# Altium schematic sheet MCU098_07_Hardware.SchDoc: Hardware
size 431 x 279 mm; Date: Not shown in title block; ApprovedBy: Not shown in title block; CheckedBy: Not shown in title block; Author: Not shown in title block; CompanyName: Not shown in title block; DrawnBy: Johnson He; Engineer: Not shown in title block; Organization: Not shown in title block; Address1: Not shown in title block; Address2: Not shown in title block; Address3: Not shown in title block; Address4: Not shown in title block; DocumentNumber: 1; Revision: Use project parameter SCH_Rev; SheetNumber: 7; SheetTotal: 7; PageSetup: Record=PageOptions|CenterHorizontal=True|CenterVertical=True|PrintScale=1.00|XCorrection=1.00|YCorrection=1.00|PrintKind=0|BorderSize=5000000|LeftOffset=0|BottomOffset=0|Orientation=2|PaperLength=1000|PaperWidth=1000|Scale=100|PaperSource=15|PrintQuality=600|MediaType=1|DitherType=10|PaperKind=Letter|PrintScaleMode=1; CurrentTime: Not shown in title block; CurrentDate: Not shown in title block; Time: Not shown in title block; DocumentFullPathAndName: Not shown in title block; DocumentName: Not shown in title block; ModifiedDate: Not shown in title block; ImagePath: Not shown in title block
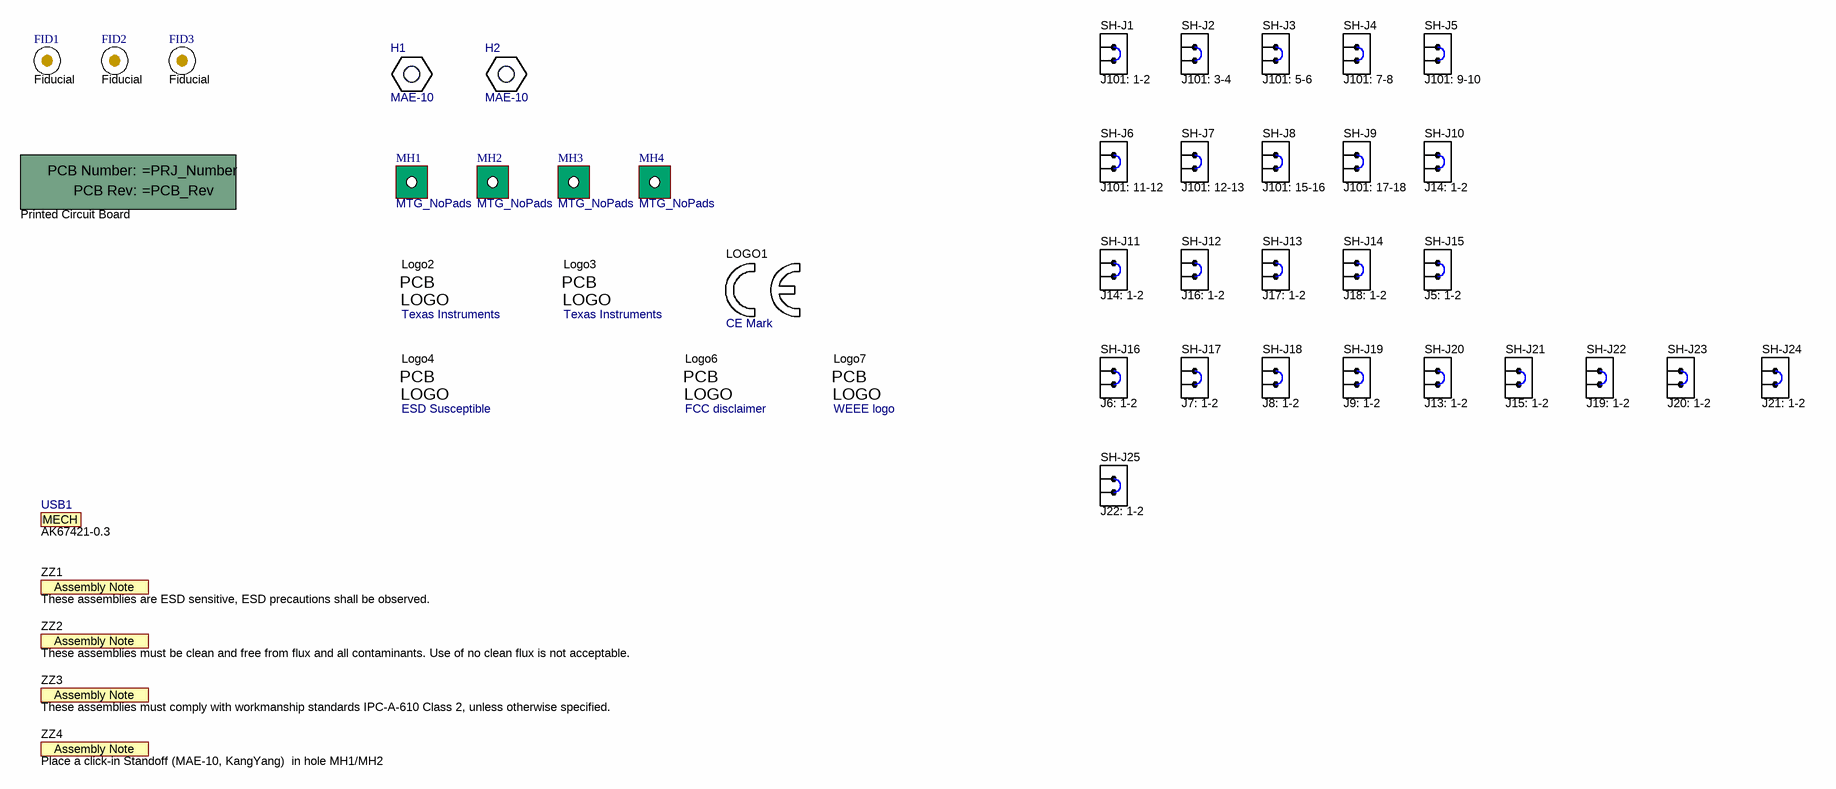
[diagram p0: MCU098_07_Hardware.SchDoc]

## Parts
!PCB1  Printed Circuit Board  (mechanical)
FID1  Fiducial  [Fiducial10-30]
FID2  Fiducial  [Fiducial10-30]
FID3  Fiducial  [Fiducial10-30]
H1  MAE-10  [KY_MAE-10]
H2  MAE-10  [KY_MAE-10]
LOGO1  CE Mark  [CE_Mark_5mm]  (no BOM)
Logo2  Texas Instruments  [TI_Horizontal_Overlay_Small]  (no BOM)
Logo3  Texas Instruments  [TI_Horizontal_Overlay_Medium]  (no BOM)
Logo4  ESD Susceptible  [ESD_Overlay_Large]  (no BOM)
Logo6  FCC disclaimer  [FCC_disclaimer]  (no BOM)
Logo7  WEEE logo  [WEEE_Minimum]  (no BOM)
MH1  MTG_NoPads  [NPTH125mil]  (no BOM)
MH2  MTG_NoPads  [NPTH125mil]  (no BOM)
MH3  MTG_NoPads  [NPTH125mil]  (no BOM)
MH4  MTG_NoPads  [NPTH125mil]  (no BOM)
SH-J1  value J101: 1-2  [SNT-100-BK-G]  (hidden comment: SNT-100-BK-G)
SH-J2  value J101: 3-4  [SNT-100-BK-G]  (hidden comment: SNT-100-BK-G)
SH-J3  value J101: 5-6  [SNT-100-BK-G]  (hidden comment: SNT-100-BK-G)
SH-J4  value J101: 7-8  [SNT-100-BK-G]  (hidden comment: SNT-100-BK-G)
SH-J5  value J101: 9-10  [SNT-100-BK-G]  (hidden comment: SNT-100-BK-G)
SH-J6  value J101: 11-12  [SNT-100-BK-G]  (hidden comment: SNT-100-BK-G)
SH-J7  value J101: 12-13  [SNT-100-BK-G]  (hidden comment: SNT-100-BK-G)
SH-J8  value J101: 15-16  [SNT-100-BK-G]  (hidden comment: SNT-100-BK-G)
SH-J9  value J101: 17-18  [SNT-100-BK-G]  (hidden comment: SNT-100-BK-G)
SH-J10  value J14: 1-2  [SNT-100-BK-G]  (hidden comment: SNT-100-BK-G)
SH-J11  value J14: 1-2  [SNT-100-BK-G]  (hidden comment: SNT-100-BK-G)
SH-J12  value J16: 1-2  [SNT-100-BK-G]  (hidden comment: SNT-100-BK-G)
SH-J13  value J17: 1-2  [SNT-100-BK-G]  (hidden comment: SNT-100-BK-G)
SH-J14  value J18: 1-2  [SNT-100-BK-G]  (hidden comment: SNT-100-BK-G)
SH-J15  value J5: 1-2  [SNT-100-BK-G]  (hidden comment: SNT-100-BK-G)
SH-J16  value J6: 1-2  [SNT-100-BK-G]  (hidden comment: SNT-100-BK-G)
SH-J17  value J7: 1-2  [SNT-100-BK-G]  (hidden comment: SNT-100-BK-G)
SH-J18  value J8: 1-2  [SNT-100-BK-G]  (hidden comment: SNT-100-BK-G)
SH-J19  value J9: 1-2  [SNT-100-BK-G]  (hidden comment: SNT-100-BK-G)
SH-J20  value J13: 1-2  [SNT-100-BK-G]  (hidden comment: SNT-100-BK-G)
SH-J21  value J15: 1-2  [SNT-100-BK-G]  (hidden comment: SNT-100-BK-G)
SH-J22  value J19: 1-2  [SNT-100-BK-G]  (hidden comment: SNT-100-BK-G)
SH-J23  value J20: 1-2  [SNT-100-BK-G]  (hidden comment: SNT-100-BK-G)
SH-J24  value J21: 1-2  [SNT-100-BK-G]  (hidden comment: SNT-100-BK-G)
SH-J25  value J22: 1-2  [SNT-100-BK-G]  (hidden comment: SNT-100-BK-G)
USB1  AK67421-0.3  (mechanical)
ZZ1  These assemblies are ESD sensitive, ESD precautions shall be observed.  [AssemblyNote]  (no BOM)
ZZ2  These assemblies must be clean and free from flux and all contaminants. Use of no clean flux is not acceptable.  [AssemblyNote]  (no BOM)
ZZ3  These assemblies must comply with workmanship standards IPC-A-610 Class 2, unless otherwise specified.  [AssemblyNote]  (no BOM)
ZZ4  Place a click-in Standoff (MAE-10, KangYang)  in hole MH1/MH2  [AssemblyNote]  (no BOM)

## Notes on the sheet
- Drawn By:
- SVN Rev:
- Number:
- TID #:
- Orderable:
- Rev:
- Sheet Title:
- File:
- Project Title:
- Designed for:
- Assembly Variant:
- Mod. Date:
- Sheet:
- Size:
- of
- B
- http://www.ti.com
- Texas Instruments and/or its licensors do not warrant the accuracy or completeness of this specification or any information contained therein. Texas Instruments and/or its licensors do not warrant that this design will meet the specifications, will be suitable for your application or fit for any particular purpose, or will operate in an implementation. Texas Instruments and/or its licensors do not warrant that the design is production worthy. You should completely validate and test your design implementation to confirm the system functionality for your application.
- Engineer:
- Contact:
- © Texas Instruments
- (in symbol AssemblyNote) Assembly Note
- (in symbol CMP-0003618-2) PCB Number:; PCB Rev:
- (in symbol CMP-0074769-1) PCB; LOGO
- (in symbol CMP-0074838-1) PCB; LOGO
- (in symbol CMP-0074840-1) PCB; LOGO
- (in symbol CMP-0074847-1) PCB; LOGO
- (in symbol CMP-0077983-1) MECH

## Library data of the parts
!PCB1 = CMP-0003618-2: Manufacturer: Any; PartNumber: =PRJ_Number; LatestRevisionDate: 2017-03-09; CompType: PCB; Publisher: Texas Instruments; RoHS: O; MountType: N/A; Key: PCB
FID1-FID3 = CMP-0077181-1: Fiducial mark.  There is nothing to buy or mount.; CompType: Fiducial; PackageReference: N/A; Library Reference: Fiducial; ClassName: FiducialMark; Manufacturer: N/A; MountType: N/A; PartNumber: N/A
H1 H2 = CMP-0077978-1: Spacer Support, Nylon 66; Manufacturer: Kang Yang; CompType: Standoff; PartNumber: MAE-10; Key: MAE-10; PackageReference: Spacer Nylon Support; ComponentLink1Description: Datasheet Link; MountType: N/A; ComponentLink1URL: https://sps16.itg.ti.com/sites/KMS/crossdivteams/altium/docs/ComponentDatasheets/1104004000018---MAE-10.pdf; RoHS: Y
LOGO1 = CMP-0074844-1: SymbolCreator: a0412235; Publisher: Texas Instruments; Library Reference: CE Mark; Lib Reference: CE Mark; LatestRevisionDate: 2017-07-06; PartNumber: CE Mark; Published: 2009-03-03
Logo2 Logo3 = CMP-0074838-1: Texas Instrument Corporate Signature; SymbolCreator: a0412235; Lib Reference: TI_Logo; ClassName: Logo; Library Reference: Logo; Publisher: Texas Instruments; SymbolVersion: 2011-08-22; Published: 2009-03-03; LatestRevisionDate: 2017-07-06; PartNumber: Texas Instruments
Logo4 = CMP-0074840-1: ESD Susceptible Symbol; SymbolCreator: a0412235; Lib Reference: ESD_Susceptible; Library Reference: Logo; Publisher: Texas Instruments; SymbolVersion: 2011-08-22; Published: 2009-03-03; LatestRevisionDate: 2017-07-06; PartNumber: ESD Susceptible
Logo6 = CMP-0074847-1: FCC_disclaimer; Publisher: Texas Instruments; Lib Reference: FCC_disclaimer; Library Reference: Logo; LatestRevisionDate: 2017-07-06; PartNumber: FCC disclaimer; Published: 2009-03-03
Logo7 = CMP-0074769-1: Library Reference: WEEE logo; Lib Reference: WEEE logo; PartNumber: WEEE logo
MH1-MH4 = CMP-0078424-2: PCB Mounting Hole, No Pad; Manufacturer: Any; Key: Mounting Hole (non-standard) No Pad; CompType: Mounting Hole; PackageReference: Mounting Hole; PartNumber: N/A; MountType: N/A
SH-J1-SH-J25 = CMP-0003623-3: Shunt, 100mil, Gold plated, Black; Alternate PartNumber: 969102-0000-DA; Manufacturer: Samtec; Alternate Manufacturer: 3M; ComponentLink1URL: http://www.samtec.com/ftppub/pdf/SNT.PDF; Supplier 1: Digi-Key; CompType: Shunt; PackageReference: Shunt; ClassName: Shunt; RoHS: Y; Supplier Part Number 1: SAM8858-ND; MountType: N/A; PartNumber: SNT-100-BK-G; ComponentLink1Description: Datasheet Link
USB1 = CMP-0077983-1: Cable, USB-A to micro USB-B, 0.3 m; Manufacturer: Assman WSW; ComponentLink1URL: http://www.assmann-wsw.com/fileadmin/datasheets/ASS_7091_CA.pdf; Key: AK67421-0.3; CompType: Cable; Supplier 1: Digi-Key; RoHS: Y; Supplier Part Number 1: AE11229-ND; PartNumber: AK67421-0.3; MountType: N/A; ComponentLink1Description: Datasheet Link
ZZ1-ZZ4 = AssemblyNote: SymbolCreator: codlsc; SymbolVersion: 2010-05-18; CompType: AssemblyNote; ClassName: AssemblyNote; Publisher: Texas Instruments; LatestRevisionDate: 2012-06-14; LatestRevisionNote: Initial Version; Alternate Manufacturer: -; Alternate PartNumber: -